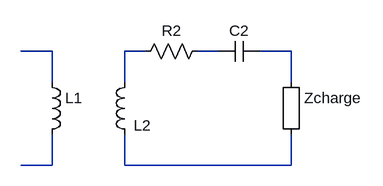
[diagram p0: schematic Draft4.asc]
Draft4.asc, the LTspice schematic file:
Version 4
SHEET 1 880 680
WIRE 80 32 32 32
WIRE 224 32 192 32
WIRE 336 32 304 32
WIRE 448 32 400 32
WIRE 80 80 80 32
WIRE 192 80 192 32
WIRE 448 80 448 32
WIRE 80 208 80 160
WIRE 80 208 32 208
WIRE 192 208 192 160
WIRE 448 208 448 160
WIRE 448 208 192 208
SYMBOL ind 64 64 R0
SYMATTR InstName L1
SYMATTR Value ""
SYMBOL ind 208 176 R180
WINDOW 0 -25 30 Left 2
WINDOW 3 36 40 Left 2
SYMATTR InstName L2
SYMATTR Value ""
SYMBOL res 320 16 R90
WINDOW 0 0 56 VBottom 2
WINDOW 3 32 56 VTop 2
SYMATTR InstName R2
SYMATTR Value ""
SYMBOL cap 400 16 R90
WINDOW 0 0 32 VBottom 2
WINDOW 3 32 32 VTop 2
SYMATTR InstName C2
SYMATTR Value ""
SYMBOL Misc\\EuropeanResistor 432 64 R0
SYMATTR InstName Zcharge
SYMATTR Value ""

The netlist it stands for:
* Draft4.asc
L1 N001 N005
L2 N006 N002
R2 N003 N002
C2 N004 N003
R§Zcharge N004 N006
.backanno
.end